# Altium schematic sheet Power.SchDoc
size A4; SheetNumber: 2; SheetTotal: 2
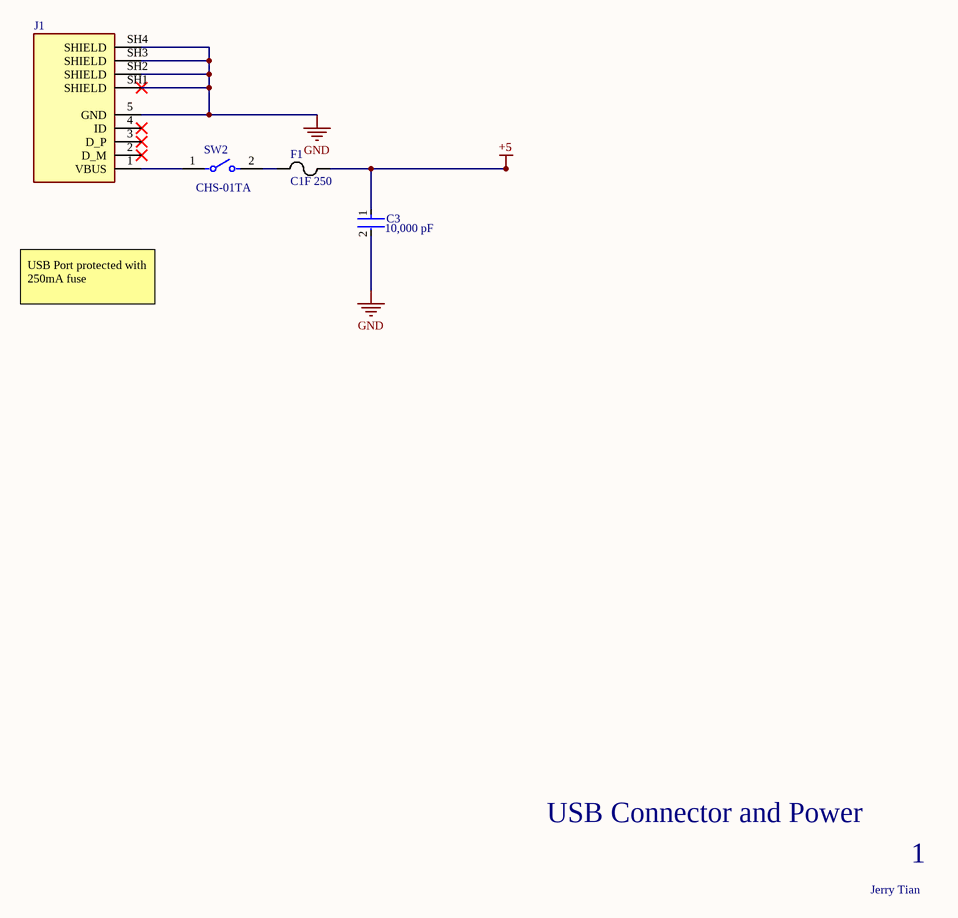
[diagram p0: Power.SchDoc]

## Parts
C3  Capacitance: 10,000 pF  [FP-C1206C-EB-MFG]  (hidden comment: C1206C103K5RAC7210)
F1  C1F 250  [C1_BEL]
J1  DX4R005HJ5R2000  [JAE_DX4R005HJ5R2000]  (value not drawn)
SW2  CHS-01TA  [FP-CHS-01TA-MFG]

## Nets
+5: C3.1 F1.2
GND: C3.2 J1.5(GND) J1.SH1(SHIELD) J1.SH2(SHIELD) J1.SH3(SHIELD) J1.SH4(SHIELD)
NetF1_1: F1.1 SW2.2
NetJ1_1: J1.1(VBUS) SW2.1

Not connected (* = marked no-connect by the designer): J1 2(D_M)* 3(D_P)* 4(ID)*

## Notes on the sheet
- USB Port protected with 250mA fuse
- USB Connector and Power
- 1
- Jerry Tian

## Library data of the parts
C3 = CMP-03020-021901-1: CAP CER 10000PF 50V X7R 1206; Manufacturer: KEMET; Material: Ceramic; Automotive Grade: Grade 0; Tolerance: 0.1; Temperature Coefficient: 15%; Value: 10,000 pF; ComponentLink2URL: https://content.kemet.com/datasheets/KEM_C1007_X8R_ULTRA_150C_SMD.pdf; Device Class L3: Ceramic Capacitors; Manufacturer Part Number: C1206C103K5RAC7210; Device Class L1: Passive Components; Device Class L2: Capacitors; Digikey Description: CAP CER 10000PF 50V X7R 1206; Temperature Characteristic: X7R; Ipc Land Pattern Name: CAPC320160X78; Automotive: Yes; Voltage Rating: 50 V; Height: 0.88mm; RoHS: TRUE; ComponentLink2Description: Datasheet; Temperature: -55°C to +150°C; Category: Cap; Package: C1206C-EB; Octopart: https://octopart.com/c1206c103k5rac7210-kemet-3918401; Lead Free: Yes; Temperature Range High: +150°C; Temperature Range Low: -55°C; Mouser Description: Multilayer Ceramic Capacitors MLCC - SMD/SMT 50volts 10000pF X7R 10%
F1 = C1F 250: No Description Available; Mfr_Name: Belfuse; Type: DEV; Copyright: Copyright (C) 2022 Ultra Librarian. All rights reserved.; Manufacturer_Part_Number: C1F 250; Digi-Key_Part_Number_1: 507-1874-1-ND; Digi-Key_Part_Number_2: 507-1874-2-ND; Digi-Key_Part_Number_3: 507-1874-6-ND; RefDes: RefDes
J1 = DX4R005HJ5R2000: USB - micro B USB 2.0 Receptacle Connector 5 Position Surface Mount, Right Angle; MF: JAE Electronics; Value: *; Price: None; Package: None; SnapEDA_Link: https://www.snapeda.com/parts/DX4R005HJ5R2000/JAE%20Electronics/view-part/554854/?ref=snap; Availability: Unavailable; MP: DX4R005HJ5R2000
SW2 = CMP-71740-000003-1: SWITCH SLIDE DIP SPST 100MA 6V; Manufacturer: Nidec Copal Electronics; Contact Resistance: 50mΩ; Standoff Height: 0mm; Number Of Circuits: 1; Electromechanical Life: 2000Cycles; Device Class L1: Electromechanical; Device Class L2: Switches; Category: Switch; Temperature Range Low: -40°C; Device Class L3: DIP Switches; Height: 2.5mm; Lead Free: Yes; Octopart: https://octopart.com/chs-01ta-nidec+copal-52304644; Throw Configuration: SPST; Package: CHS-01TA; Voltage Rating Dc: 6V; Digikey Description: SWITCH SLIDE DIP SPST 100MA 6V; Mount: Surface Mount; Automotive: No; Contact Current Rating: 100mA; ComponentLink2URL: https://www.nidec-copal-electronics.com/e/catalog/switch/chs.pdf; ComponentLink2Description: Datasheet; Temperature: -40°C to +85°C; Temperature Range High: +85°C; RoHS: TRUE; Manufacturer Part Number: CHS-01TA